# EAGLE design regulateur (EAGLE 7.5.0)
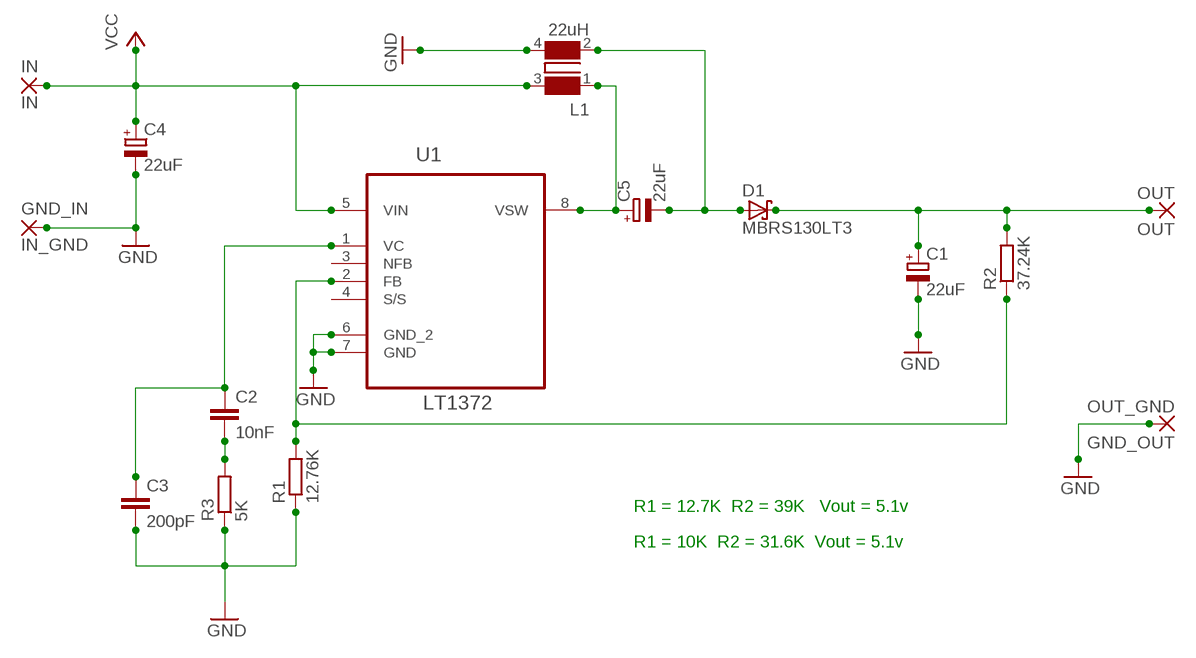
[diagram p0: schematic, sheet 1]

## Parts
C1  22uF  CPOL-EUCT7343  [CT7343]
C2  10nF  C-EUC1206  [C1206]
C3  200pF  C-EUC1206  [C1206]
C4  22uF  CPOL-EUCT7343  [CT7343]
C5  22uF  CPOL-EUCT7343  [CT7343]
D1  MBRS130LT3  [SMB]
GND_IN  IN_GND  3,81/1,3  [3,81/1,3]
GND_OUT  OUT_GND  3,81/1,3  [3,81/1,3]
IN  IN  3,81/1,3  [3,81/1,3]
L1  22uH  WE-DD-744871220_1260/1280/1210_CROSSED  [WE-DD_12XX_CROSSED]
OUT  OUT  3,81/1,3  [3,81/1,3]
R1  12.76K  R-EU_M1206  [M1206]
R2  37.24K  R-EU_M1206  [M1206]
R3  5K  R-EU_M1206  [M1206]
U1  LT1372  LT1372CS8PBF  [SOIC127P600X175-8N]

## Nets
GND: C1.- C3.2 C4.- GND_IN.1(P) GND_OUT.1(P) L1.4 R1.1 R3.1 U1.6(GND_2) U1.7(GND)
N$1: C2.2 R3.2
N$2: C2.1 C3.1 U1.1(VC)
N$4: C5.+ L1.1 U1.8(VSW)
N$5: C5.- D1.A L1.2
N$6: C1.+ D1.C OUT.1(P) R2.2
N$7: R1.2 R2.1 U1.2(FB)
VCC: C4.+ IN.1(P) L1.3 U1.5(VIN)
Unconnected: U1.3(NFB) U1.4(S/S)

## Notes on the sheet
- R1 = 12.7K  R2 = 39K   Vout = 5.1v
- R1 = 10K  R2 = 31.6K  Vout = 5.1v

## Library data of the parts
C1 C4 C5 = resistor:CPOL-EU: POLARIZED CAPACITOR, European symbol
C2 C3 = resistor:C-EU: CAPACITOR, European symbol
D1 = diode:MBRS130LT3: Schottky Power Rectifier Source: http://www.onsemi.com/pub/Collateral/MBRS130LT3-D.PDF
GND_IN GND_OUT IN OUT = wirepad:3,81/1,3: THROUGH-HOLE PAD
L1 = WE-DD:WE-DD: SMD-Shielded Coupled Inductor WE-DD - 1:1 transformer - Double inductor with two identical windings - Straight and crossed pin layout available - Customer specific designs available upon request -- for SEPIC and CUK topologies -- Flyback applications -- Switching regulators with second, unregulated output voltag; MPN: 744871220; OC_FARNELL: 1869682; OC_NEWARK: 32T8604; PACKAGE: 1260_Crossed; SUPPLIER: Wuerth Elektronik
R1-R3 = resistor:R-EU_: RESISTOR, European symbol
U1 = LTC_By_element14_Batch_1:LT1372CS8PBF: Switching Regulators; MPN: LT1372CS8#PBF; OC_FARNELL: 1273736; OC_NEWARK: 57M3607; PACKAGE: SOIC-8; SUPPLIER: Linear Technology

## Net classes
0 default: clearance 0.205 mm

## Board
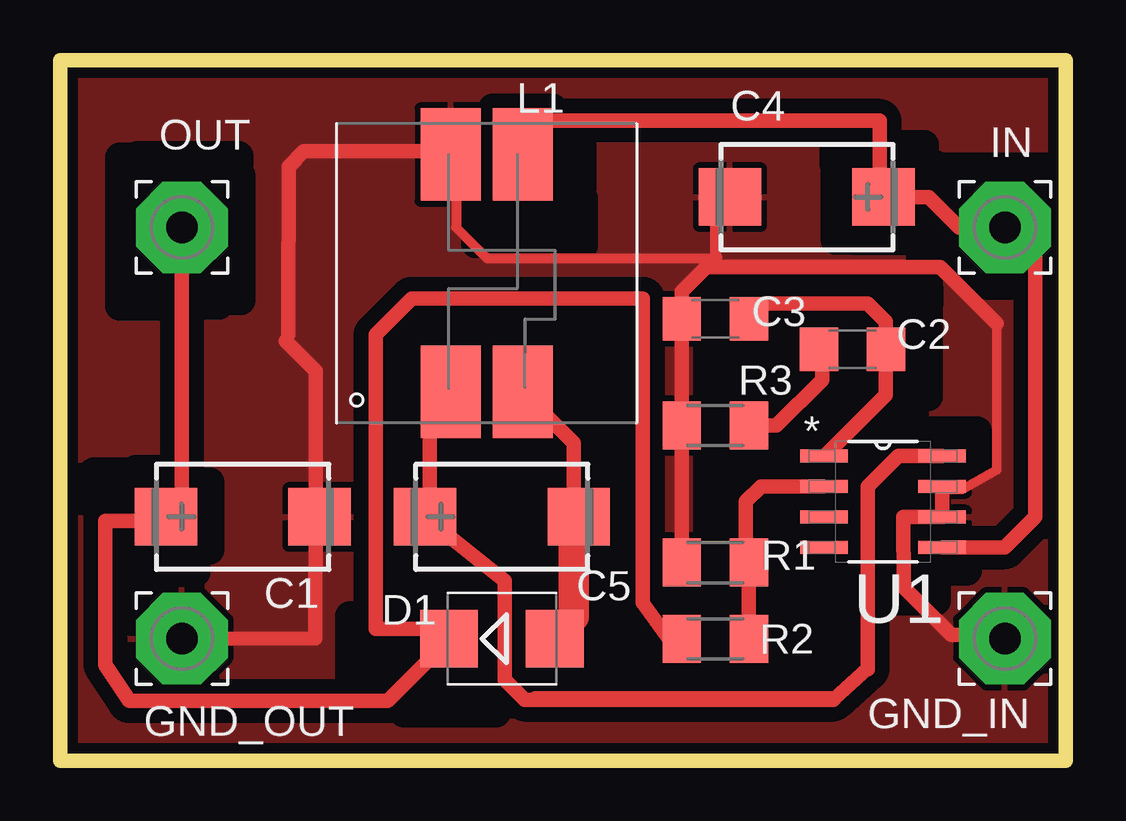
[diagram p1: board, top side]
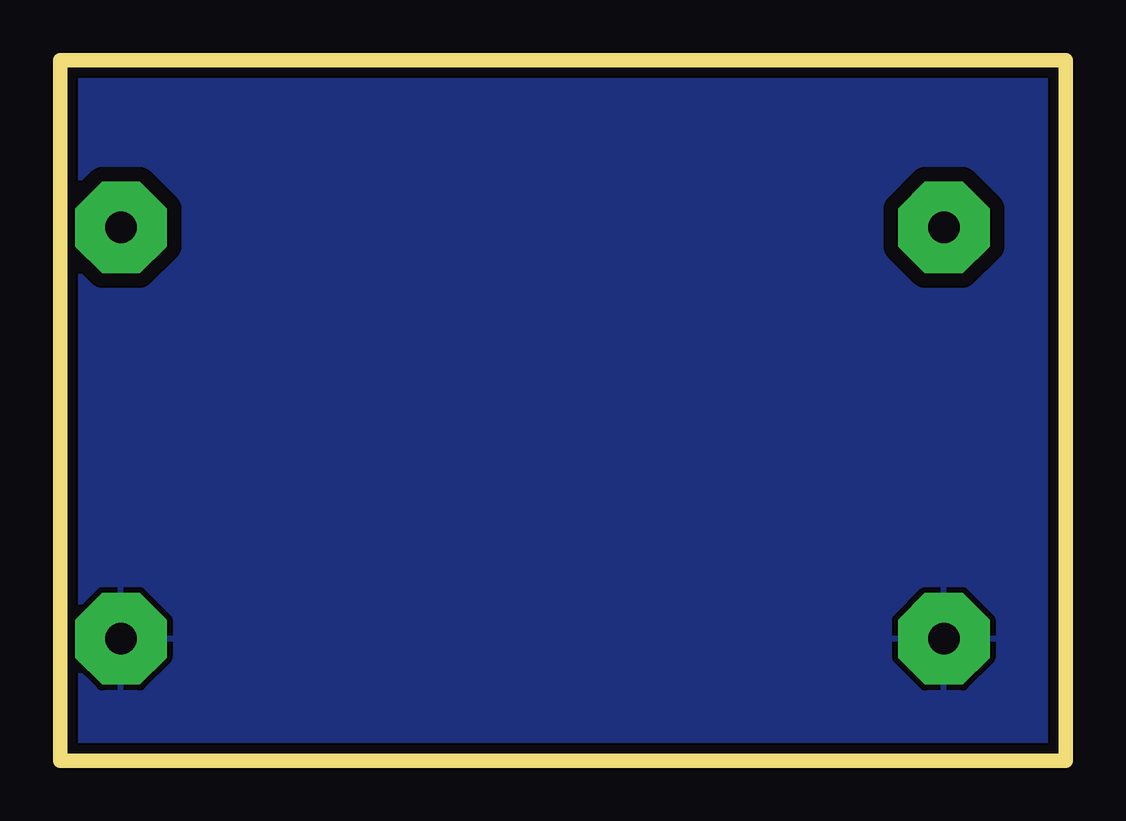
[diagram p2: board, bottom side, seen from below]

Size 41.91 x 29.21 mm. Coordinates in mm from the lower left corner, seen from the top.
Outline: 0,0 41.91,0 41.91,29.21 0,29.21 0,0
Copper layers (1*16): Top 0.035mm / dielectric 1.5mm / Bottom 0.035mm
Design rules "SparkFun *": minimum track width 0.4032mm, minimum drill 20mil, track to track 0.4032mm, track to pad 8mil, pad to pad 8mil, via to via 8mil, smd to smd 8mil, copper to edge 10mil, drill to drill 8mil, minimum pad ring 12mil, minimum via ring 10mil, stop-mask expansion 4mil, vias tented up to drill 25mil, thermal gap 10mil
tRestrict: area 18.2,21.5 to 21.8,23.5; area 20.4,21.8 to 21.7,26.4; area 33.2,12.6 to 34.2,13.3; area 33.8,13.2 to 35.4,14; area 35.5,15.2 to 36.2,18.1; area 35,14 to 35.6,15.8; area 34.5,14 to 35.1,14.5; area 36.2,13.2 to 38.2,13.7; area 35.2,18.1 to 36.2,19.4; area 34.8,12 to 37.2,12.4; area 15.8,2.6 to 17.9,3.7; area 15,2.6 to 15.7,3.6; 38 more areas
Milling: 4 lines

### Footprints (pad centres in the part's own frame; a part is rotated, then mirrored left to right if it is on the bottom)
CT7343 = smd 2.6 x 2.4: + 3.2,0; - -3.2,0
C1206 = smd 1.6 x 1.8: 1 -1.4,0; 2 1.4,0
SMB = smd 2.4 x 2.4: A 2.2,0; C -2.2,0
3,81/1,3 = drill 1.321 pad 3.81 octagon: 1 0,0
WE-DD_12XX_CROSSED = smd 2.5 x 3.85: 1 1.5,4.95; 2 -1.5,4.95; 3 -1.5,-4.95; 4 1.5,-4.95
M1206 = smd 1.6 x 2: 1 -1.4,0; 2 1.4,0
SOIC127P600X175-8N = smd 1.981 x 0.533: 1 -2.464,1.905; 2 -2.464,0.635; 3 -2.464,-0.635; 4 -2.464,-1.905; 5 2.464,-1.905; 6 2.464,-0.635; 7 2.464,0.635; 8 2.464,1.905

### Placement (x,y rotation side)
C1  7.62,10.16 180 top
C2  33.02,17.14 180 top
C3  27.3,18.41 180 top
C4  31.12,23.5 0 top
C5  18.41,10.16 180 top
D1  18.41,5.08 0 top
GND_IN  39.37,5.08 0 top
GND_OUT  5.08,5.08 0 top
IN  39.37,22.22 0 top
L1  17.78,20.32 180 top
OUT  5.08,22.22 0 top
R1  27.3,8.25 0 top
R2  27.3,5.08 180 top
R3  27.3,13.97 0 top
U1  34.29,10.79 0 top

### Tracks (layer width: path | path; a pad name or v marks a point on that pad's centre or on a via)
GND
  Top 0.403: 36.76,10.25 U1.6 36.8,10.16 | 36.76,11.25 U1.7 36.79,11.31 37.6,11.31 39.04,12.12 39.04,18.23 | 39.15,5.24 GND_IN.1 | 26.9,22.49 27.9,23.49 C4.- | 9.4,17.74 9.51,17.76 | 27.12,20.58 27.02,20.68 | 10.65,10.24 10.65,10.74 C1.- 10.65,10.24
  Top 0.406: 15.88,25.4 L1.4 16.51,24.76 16.51,22.22 17.78,20.96 27.3,20.96 | 27.3,20.96 27.3,22.86 C4.- | 26.67,20.32 27.02,20.68 27.3,20.96
  Top 0.61: 36.76,11.25 36.76,10.25 | 36.8,10.16 35.14,10.16 35.15,7.22 37.13,5.24 39.15,5.24 | 9.4,17.49 10.65,16.24 10.65,10.74 10.63,5.09 GND_OUT.1 | 9.51,17.76 9.51,18.49 9.53,24.76 10.16,25.4 15.88,25.4 | 39.04,18.23 36.68,20.58 27.12,20.58 | R1.1 R3.1 C3.2 25.91,19.55 27.3,20.96
  pour Top (isolate 0.61): 0,29.21 41.91,29.21 41.91,0 0,0
  pour Bottom (isolate 0.61): 0.32,28.89 41.59,28.89 41.59,0.32 0.32,0.32
N$1
  Top 0.61: R3.2 29.84,13.97 31.75,15.87 31.75,17.01 C2.2
N$2
  Top 0.403: 31.9,12.74 U1.1 | 34.4,17.24 C2.1 34.4,16.99
  Top 0.61: 31.9,12.74 34.4,15.24 34.4,16.99 | 34.4,17.24 34.4,18.3 33.66,19.05 29.34,19.05 C3.1
N$4
  Top 0.403: 15.4,9.99 C5.+ 15.4,10.24 | 15.4,14.49 L1.1
  Top 0.406: 33.66,3.81 33.64,3.83
  Top 0.61: 32.28,2.6 33.64,3.83 | 19.8,2.6 32.28,2.6 | 15.4,9.99 18.54,7.49 18.54,3.37 19.37,2.54 32.21,2.54 32.28,2.6 | 15.4,10.24 15.4,14.49 | 33.66,3.81 33.66,11.43 34.92,12.7 U1.8
N$5
  Top 0.403: 21.4,5.99 20.65,5.24 D1.A | 21.4,9.99 C5.- 21.4,10.24 | 19.4,15.24 L1.2
  Top 0.61: 19.4,15.24 21.4,13.24 21.4,10.24
  Top 1.27: 21.4,9.99 21.4,5.99
N$6
  Top 0.403: 16.15,5.24 D1.C | 4.65,10.24 C1.+ 4.15,9.99 | 16.15,5.49 D1.C | 16.15,4.99 D1.C
  Top 0.406: 5.08,10.16 C1.+
  Top 0.61: 16.15,5.49 13.15,5.49 13.15,17.76 14.65,19.26 24.29,19.26 24.29,6.58 25.37,5.08 R2.2 | 16.15,4.99 13.65,2.49 2.88,2.49 1.89,4 1.89,10 4.15,9.99 | OUT.1 5.08,10.16
N$7
  Top 0.61: R2.1 R1.2 28.57,8.38 28.57,10.79 29.21,11.43 U1.2
VCC
  Top 0.403: 19.4,26.68 L1.3 | 34.15,23.74 C4.+
  Top 0.61: 19.4,26.68 34.15,26.68 34.15,23.74 | C4.+ 36.2,23.5 37.46,22.22 IN.1 40.64,22.22 40.64,10.16 39.37,8.89 U1.5